# EAGLE design Power_Monitoring_Circuts (EAGLE 9.1.3)
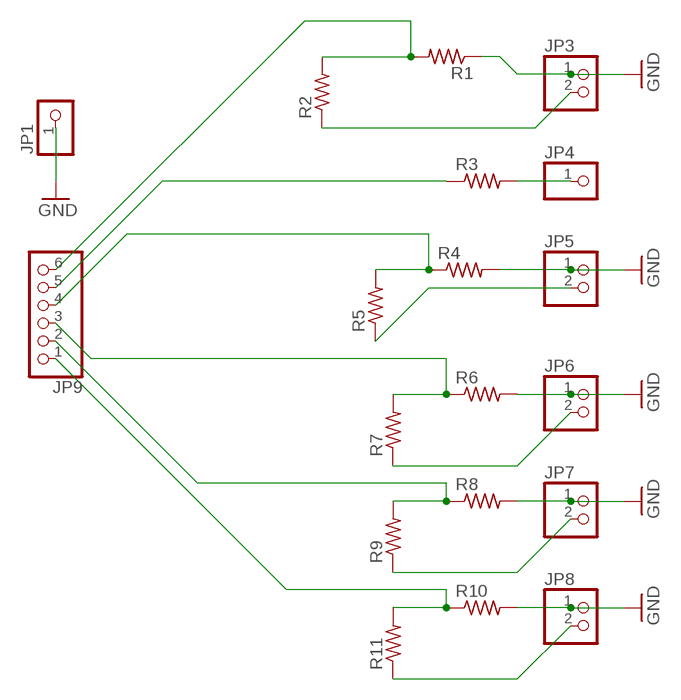
[diagram p0: schematic, sheet 1]

## Parts
JP1  PINHD-1X1  [1X01]
JP3  PINHD-1X2  [1X02]
JP4  PINHD-1X1  [1X01]
JP5  PINHD-1X2  [1X02]
JP6  PINHD-1X2  [1X02]
JP7  PINHD-1X2  [1X02]
JP8  PINHD-1X2  [1X02]
JP9  PINHD-1X6  [1X06]
R1  R-US_0204/7  [0204/7]
R2  R-US_0204/7  [0204/7]
R3  R-US_0204/7  [0204/7]
R4  R-US_0204/7  [0204/7]
R5  R-US_0204/7  [0204/7]
R6  R-US_0204/7  [0204/7]
R7  R-US_0204/7  [0204/7]
R8  R-US_0204/7  [0204/7]
R9  R-US_0204/7  [0204/7]
R10  R-US_0204/7  [0204/7]
R11  R-US_0204/7  [0204/7]

## Nets
GND: JP1.1 JP3.1 JP5.1 JP6.1 JP7.1 JP8.1 R1.1 R4.2 R6.2 R8.2 R10.2
N$2: JP9.6 R1.2 R2.2
N$3: JP3.2 R2.1
N$4: JP4.1 R3.2
N$6: JP9.4 R4.1 R5.2
N$7: JP5.2 R5.1
N$9: JP9.3 R6.1 R7.2
N$10: JP6.2 R7.1
N$12: JP9.2 R8.1 R9.2
N$13: JP9.5 R3.1
N$15: JP9.1 R10.1 R11.2
N$16: JP8.2 R11.1
N$18: JP7.2 R9.1

## Library data of the parts
JP1 JP4 = pinhead:PINHD-1X1: PIN HEADER
JP3 JP5-JP8 = pinhead:PINHD-1X2: PIN HEADER
JP9 = pinhead:PINHD-1X6: PIN HEADER
R1-R11 = resistor:R-US_: RESISTOR, American symbol

## Net classes
0 default: width 1.016 mm, drill 1.016 mm, clearance 0.508 mm

## Board
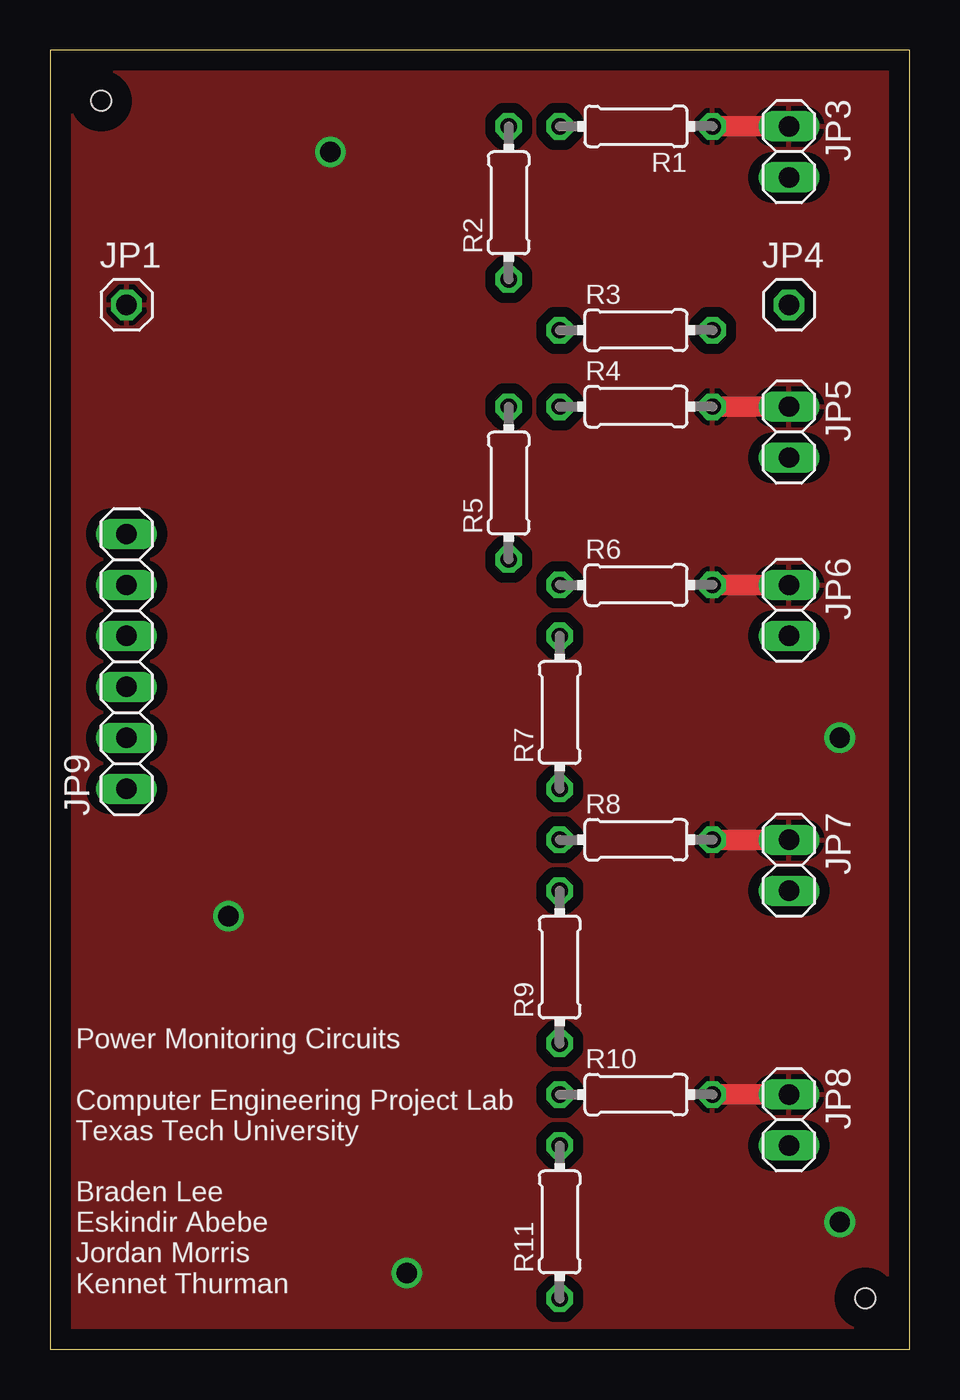
[diagram p1: board, top side]
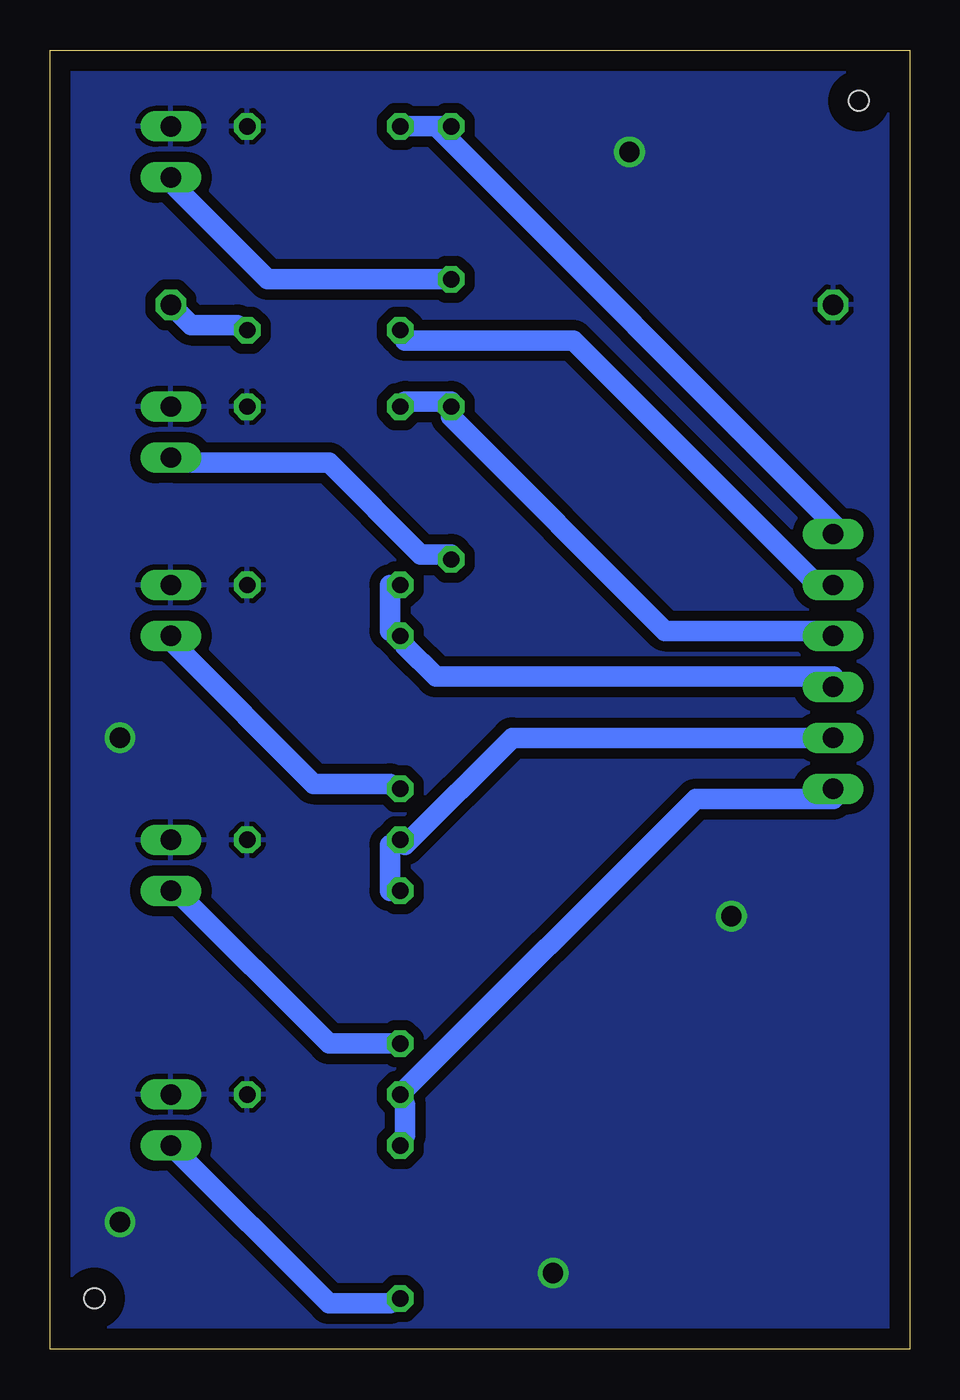
[diagram p2: board, bottom side, seen from below]

Size 42.85 x 64.76 mm. Coordinates in mm from the lower left corner, seen from the top.
Outline: 0,0 42.85,0 42.85,64.76 0,64.76 0,0
Copper layers (1*16): Top 0.035mm / dielectric 1.5mm / Bottom 0.035mm
Design rules "default": minimum track width 6mil, minimum drill 0.35mm, track to track 6mil, track to pad 6mil, pad to pad 6mil, via to via 6mil, smd to smd 6mil, copper to edge 40mil, drill to drill 6mil, minimum pad ring 10mil, minimum via ring 8mil, stop-mask expansion 4mil, vias tented up to drill 0mil, thermal gap 10mil
Holes 1 mm at 2.54,62.23 40.64,2.54

### Footprints (pad centres in the part's own frame; a part is rotated, then mirrored left to right if it is on the bottom)
1X01 = drill 1.016 octagon: 1 0,0
1X02 = drill 1.016 long: 1 -1.27,0; 2 1.27,0
1X06 = drill 1.016 long: 1 -6.35,0; 2 -3.81,0; 3 -1.27,0; 4 1.27,0; 5 3.81,0; 6 6.35,0
0204/7 = drill 0.813 octagon: 1 -3.81,0; 2 3.81,0

### Placement (x,y rotation side)
JP1  3.81,52.07 0 top
JP3  36.83,59.69 270 top
JP4  36.83,52.07 0 top
JP5  36.83,45.72 270 top
JP6  36.83,36.83 270 top
JP7  36.83,24.13 270 top
JP8  36.83,11.43 270 top
JP9  3.81,34.29 90 top
R1  29.21,60.96 180 top
R2  22.86,57.15 90 top
R3  29.21,50.8 0 top
R4  29.21,46.99 0 top
R5  22.86,43.18 90 top
R6  29.21,38.1 0 top
R7  25.4,31.75 90 top
R8  29.21,25.4 0 top
R9  25.4,19.05 90 top
R10  29.21,12.7 0 top
R11  25.4,6.35 90 top

### Tracks (layer width: path | path; a pad name or v marks a point on that pad's centre or on a via)
GND  (via drill 1.02)
  Top 1.016: R1.1 JP3.1 | R4.2 JP5.1 | R6.2 JP6.1 | R8.2 JP7.1 | R10.2 JP8.1
  other vias: 13.97,59.69 8.89,21.59 39.37,30.48 39.37,6.35 17.78,3.81
  pour Top: -1.27,66.04 -1.27,-1.27 44.45,-1.27 44.45,66.04
  pour Bottom: -1.27,66.04 -1.27,-1.27 44.45,-1.27 44.45,66.04
N$2
  Bottom 1.016: R1.2 23.62,60.96 | 23.62,60.96 R2.2 | 23.62,60.96 3.81,41.15 JP9.6
N$3
  Bottom 1.016: R2.1 32,53.34 36.58,57.91 JP3.2
N$4
  Bottom 1.016: JP4.1 35.81,51.05 33.53,51.05 R3.2
N$6
  Bottom 1.016: R4.1 25.15,47.24 22.86,47.24 R5.2 22.86,46.48 12.19,35.81 3.81,35.81 JP9.4
N$7
  Bottom 1.016: R5.1 22.86,39.62 24.38,39.62 28.96,44.2 36.58,44.2 JP5.2
N$9
  Bottom 1.016: R6.1 25.91,38.1 25.91,35.81 R7.2 25.15,35.05 23.62,33.53 3.81,33.53 JP9.3
N$10
  Bottom 1.016: R7.1 25.91,28.19 29.72,28.19 36.58,35.05 JP6.2
N$12
  Bottom 1.016: R9.2 25.91,22.86 25.91,25.15 R8.1 25.15,25.15 19.81,30.48 JP9.2
N$13
  Bottom 1.016: JP9.5 4.57,38.1 16.76,50.29 25.15,50.29 R3.1
N$15
  Bottom 1.016: R11.2 25.15,10.67 25.15,12.19 R10.1 10.67,27.43 3.81,27.43 JP9.1
N$16
  Bottom 1.016: JP8.2 28.96,2.29 25.91,2.29 R11.1
N$18
  Bottom 1.016: R9.1 28.96,15.24 36.58,22.86 JP7.2

### Text on the board
tPlace: Power Monitoring Circuits / / Computer Engineering Project Lab / Texas Tech University / / Braden Lee / Eskindir Abebe / Jordan Morris / Kennet Thurman